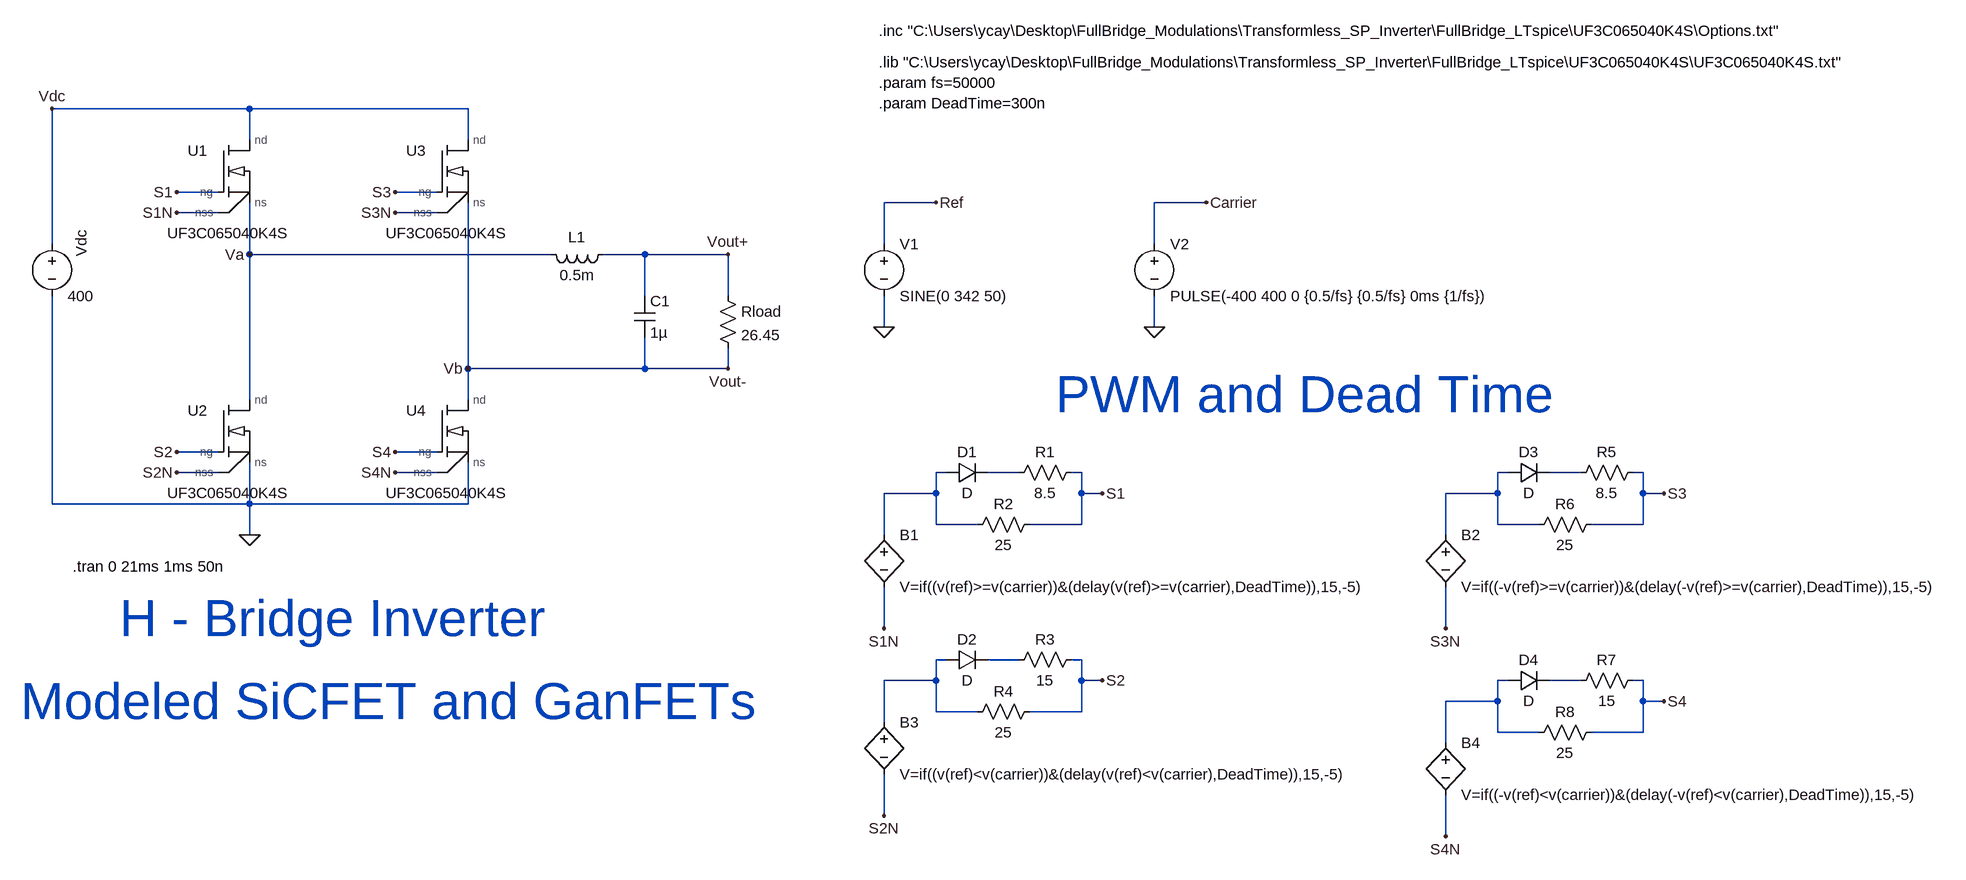
[diagram p0: schematic Unipolar_UF3C065040K4S_DeadTime.asc]
Unipolar_UF3C065040K4S_DeadTime.asc, the LTspice schematic file:
Version 4
SHEET 1 2316 864
WIRE -400 -368 -704 -368
WIRE -64 -368 -400 -368
WIRE -400 -320 -400 -368
WIRE -64 -320 -64 -368
WIRE -448 -240 -512 -240
WIRE -112 -240 -176 -240
WIRE 656 -224 576 -224
WIRE 1072 -224 992 -224
WIRE -448 -208 -512 -208
WIRE -112 -208 -176 -208
WIRE -704 -160 -704 -368
WIRE 576 -160 576 -224
WIRE 992 -160 992 -224
WIRE -400 -144 -400 -224
WIRE 64 -144 -400 -144
WIRE 208 -144 144 -144
WIRE 336 -144 208 -144
WIRE 208 -80 208 -144
WIRE 336 -80 336 -144
WIRE 576 -32 576 -80
WIRE 992 -32 992 -80
WIRE -64 32 -64 -224
WIRE 208 32 208 -16
WIRE 208 32 -64 32
WIRE 336 32 336 0
WIRE 336 32 208 32
WIRE -400 80 -400 -144
WIRE -64 80 -64 32
WIRE -448 160 -512 160
WIRE -112 160 -176 160
WIRE -448 192 -512 192
WIRE -112 192 -176 192
WIRE 672 192 656 192
WIRE 784 192 736 192
WIRE 880 192 864 192
WIRE 1536 192 1520 192
WIRE 1648 192 1600 192
WIRE 1744 192 1728 192
WIRE 656 224 656 192
WIRE 656 224 576 224
WIRE 880 224 880 192
WIRE 912 224 880 224
WIRE 1520 224 1520 192
WIRE 1520 224 1440 224
WIRE 1744 224 1744 192
WIRE 1776 224 1744 224
WIRE -704 240 -704 -80
WIRE -400 240 -400 176
WIRE -400 240 -704 240
WIRE -64 240 -64 176
WIRE -64 240 -400 240
WIRE 656 272 656 224
WIRE 720 272 656 272
WIRE 880 272 880 224
WIRE 880 272 800 272
WIRE 1520 272 1520 224
WIRE 1584 272 1520 272
WIRE 1744 272 1744 224
WIRE 1744 272 1664 272
WIRE -400 288 -400 240
WIRE 576 288 576 224
WIRE 1440 288 1440 224
WIRE 576 432 576 368
WIRE 1440 432 1440 368
WIRE 672 480 656 480
WIRE 784 480 736 480
WIRE 880 480 864 480
WIRE 656 512 656 480
WIRE 656 512 576 512
WIRE 880 512 880 480
WIRE 912 512 880 512
WIRE 1536 512 1520 512
WIRE 1648 512 1600 512
WIRE 1744 512 1728 512
WIRE 1520 544 1520 512
WIRE 1520 544 1440 544
WIRE 1744 544 1744 512
WIRE 1776 544 1744 544
WIRE 656 560 656 512
WIRE 720 560 656 560
WIRE 880 560 880 512
WIRE 880 560 800 560
WIRE 576 576 576 512
WIRE 1520 592 1520 544
WIRE 1584 592 1520 592
WIRE 1744 592 1744 544
WIRE 1744 592 1664 592
WIRE 1440 608 1440 544
WIRE 576 720 576 656
WIRE 1440 752 1440 688
FLAG 576 -32 0
FLAG 656 -224 Ref
FLAG 992 -32 0
FLAG 1072 -224 Carrier
FLAG -400 288 0
FLAG 336 -144 Vout+
FLAG 336 32 Vout-
FLAG 912 224 S1
FLAG 912 512 S2
FLAG 1776 224 S3
FLAG 1776 544 S4
FLAG 576 432 S1N
FLAG 576 720 S2N
FLAG 1440 432 S3N
FLAG 1440 752 S4N
FLAG -512 -240 S1
FLAG -512 -208 S1N
FLAG -512 160 S2
FLAG -512 192 S2N
FLAG -176 -240 S3
FLAG -176 -208 S3N
FLAG -176 192 S4N
FLAG -176 160 S4
FLAG -704 -368 Vdc
FLAG -400 -144 Va
FLAG -64 32 Vb
SYMBOL voltage 576 -176 R0
WINDOW 123 0 0 Left 0
WINDOW 39 0 0 Left 0
SYMATTR InstName V1
SYMATTR Value SINE(0 342 50)
SYMBOL voltage 992 -176 R0
WINDOW 123 0 0 Left 0
WINDOW 39 0 0 Left 0
SYMATTR InstName V2
SYMATTR Value PULSE(-400 400 0 {0.5/fs} {0.5/fs} 0ms {1/fs})
SYMBOL bv 576 272 R0
SYMATTR InstName B1
SYMATTR Value V=if((v(ref)>=v(carrier))&(delay(v(ref)>=v(carrier),DeadTime)),15,-5)
SYMBOL bv 1440 272 R0
SYMATTR InstName B2
SYMATTR Value V=if((-v(ref)>=v(carrier))&(delay(-v(ref)>=v(carrier),DeadTime)),15,-5)
SYMBOL ind 160 -160 R90
WINDOW 0 5 56 VBottom 2
WINDOW 3 32 56 VTop 2
SYMATTR InstName L1
SYMATTR Value 0.5m
SYMATTR SpiceLine Rser=30m
SYMBOL res 320 -96 R0
SYMATTR InstName Rload
SYMATTR Value 26.45
SYMBOL voltage -704 -176 R0
WINDOW 123 0 0 Left 0
WINDOW 39 0 0 Left 0
WINDOW 0 45 36 VLeft 2
SYMATTR InstName Vdc
SYMATTR Value 400
SYMBOL cap 192 -80 R0
SYMATTR InstName C1
SYMATTR Value 1µ
SYMATTR SpiceLine Rser=0.1m
SYMBOL bv 576 560 R0
SYMATTR InstName B3
SYMATTR Value V=if((v(ref)<v(carrier))&(delay(v(ref)<v(carrier),DeadTime)),15,-5)
SYMBOL bv 1440 592 R0
SYMATTR InstName B4
SYMATTR Value V=if((-v(ref)<v(carrier))&(delay(-v(ref)<v(carrier),DeadTime)),15,-5)
SYMBOL res 880 176 R90
WINDOW 0 0 56 VBottom 2
WINDOW 3 32 56 VTop 2
SYMATTR InstName R1
SYMATTR Value 8.5
SYMBOL diode 672 208 R270
WINDOW 0 32 32 VTop 2
WINDOW 3 0 32 VBottom 2
SYMATTR InstName D1
SYMBOL res 816 256 R90
WINDOW 0 0 56 VBottom 2
WINDOW 3 32 56 VTop 2
SYMATTR InstName R2
SYMATTR Value 25
SYMBOL res 880 464 R90
WINDOW 0 0 56 VBottom 2
WINDOW 3 32 56 VTop 2
SYMATTR InstName R3
SYMATTR Value 15
SYMBOL diode 672 496 R270
WINDOW 0 32 32 VTop 2
WINDOW 3 0 32 VBottom 2
SYMATTR InstName D2
SYMBOL res 816 544 R90
WINDOW 0 0 56 VBottom 2
WINDOW 3 32 56 VTop 2
SYMATTR InstName R4
SYMATTR Value 25
SYMBOL res 1744 176 R90
WINDOW 0 0 56 VBottom 2
WINDOW 3 32 56 VTop 2
SYMATTR InstName R5
SYMATTR Value 8.5
SYMBOL diode 1536 208 R270
WINDOW 0 32 32 VTop 2
WINDOW 3 0 32 VBottom 2
SYMATTR InstName D3
SYMBOL res 1680 256 R90
WINDOW 0 0 56 VBottom 2
WINDOW 3 32 56 VTop 2
SYMATTR InstName R6
SYMATTR Value 25
SYMBOL res 1744 496 R90
WINDOW 0 0 56 VBottom 2
WINDOW 3 32 56 VTop 2
SYMATTR InstName R7
SYMATTR Value 15
SYMBOL diode 1536 528 R270
WINDOW 0 32 32 VTop 2
WINDOW 3 0 32 VBottom 2
SYMATTR InstName D4
SYMBOL res 1680 576 R90
WINDOW 0 0 56 VBottom 2
WINDOW 3 32 56 VTop 2
SYMATTR InstName R8
SYMATTR Value 25
SYMBOL AutoGenerated\\UF3C065040K4S -432 -272 R0
SYMATTR InstName U1
SYMBOL AutoGenerated\\UF3C065040K4S -432 128 R0
SYMATTR InstName U2
SYMBOL AutoGenerated\\UF3C065040K4S -96 -272 R0
SYMATTR InstName U3
SYMBOL AutoGenerated\\UF3C065040K4S -96 128 R0
SYMATTR InstName U4
TEXT 568 -440 Left 2 !.lib "C:\\Users\\ycay\\Desktop\\FullBridge_Modulations\\Transformless_SP_Inverter\\FullBridge_LTspice\\UF3C065040K4S\\UF3C065040K4S.txt"
TEXT 568 -488 Left 2 !.inc "C:\\Users\\ycay\\Desktop\\FullBridge_Modulations\\Transformless_SP_Inverter\\FullBridge_LTspice\\UF3C065040K4S\\Options.txt"
TEXT -672 336 Left 2 !.tran 0 21ms 1ms 50n
TEXT 840 72 Left 6 ;PWM and Dead Time
TEXT -600 416 Left 6 ;H - Bridge Inverter
TEXT -752 544 Left 6 ;Modeled SiCFET and GanFETs
TEXT 568 -408 Left 2 !.param fs=50000\n.param DeadTime=300n

The netlist it stands for:
* Unipolar_UF3C065040K4S_DeadTime.asc
V1 Ref 0 SINE(0 342 50)
V2 Carrier 0 PULSE(-400 400 0 {0.5/fs} {0.5/fs} 0ms {1/fs})
B1 N001 S1N V=if((v(ref)>=v(carrier))&(delay(v(ref)>=v(carrier),DeadTime)),15,-5)
B2 N003 S3N V=if((-v(ref)>=v(carrier))&(delay(-v(ref)>=v(carrier),DeadTime)),15,-5)
L1 Vout+ Va 0.5m Rser=30m
Rload Vout+ Vb 26.45
Vdc Vdc 0 400
C1 Vout+ Vb 1µ Rser=0.1m
B3 N005 S2N V=if((v(ref)<v(carrier))&(delay(v(ref)<v(carrier),DeadTime)),15,-5)
B4 N007 S4N V=if((-v(ref)<v(carrier))&(delay(-v(ref)<v(carrier),DeadTime)),15,-5)
R1 S1 N002 8.5
D1 N001 N002 D
R2 S1 N001 25
R3 S2 N006 15
D2 N005 N006 D
R4 S2 N005 25
R5 S3 N004 8.5
D3 N003 N004 D
R6 S3 N003 25
R7 S4 N008 15
D4 N007 N008 D
R8 S4 N007 25
XU1 Vdc S1 Va S1N UF3C065040K4S  ; pins nd ng ns nss
XU2 Va S2 0 S2N UF3C065040K4S  ; pins nd ng ns nss
XU3 Vdc S3 Vb S3N UF3C065040K4S  ; pins nd ng ns nss
XU4 Vb S4 0 S4N UF3C065040K4S  ; pins nd ng ns nss
.model D D
.lib standard.dio
.lib "C:\Users\ycay\Desktop\FullBridge_Modulations\Transformless_SP_Inverter\FullBridge_LTspice\UF3C065040K4S\UF3C065040K4S.txt"
.inc "C:\Users\ycay\Desktop\FullBridge_Modulations\Transformless_SP_Inverter\FullBridge_LTspice\UF3C065040K4S\Options.txt"
.tran 0 21ms 1ms 50n
* PWM and Dead Time
* H - Bridge Inverter
* Modeled SiCFET and GanFETs
.param fs=50000
.param DeadTime=300n
.lib C:\Users\ycay\Desktop\FullBridge_Modulations\Transformless_SP_Inverter\FullBridge_LTspice\UF3C065040K4S\UF3C065040K4S.txt
.backanno
.end